# Altium schematic sheet Stepper.SchDoc
size 420 x 297 mm; SheetNumber: 3; SheetTotal: 4
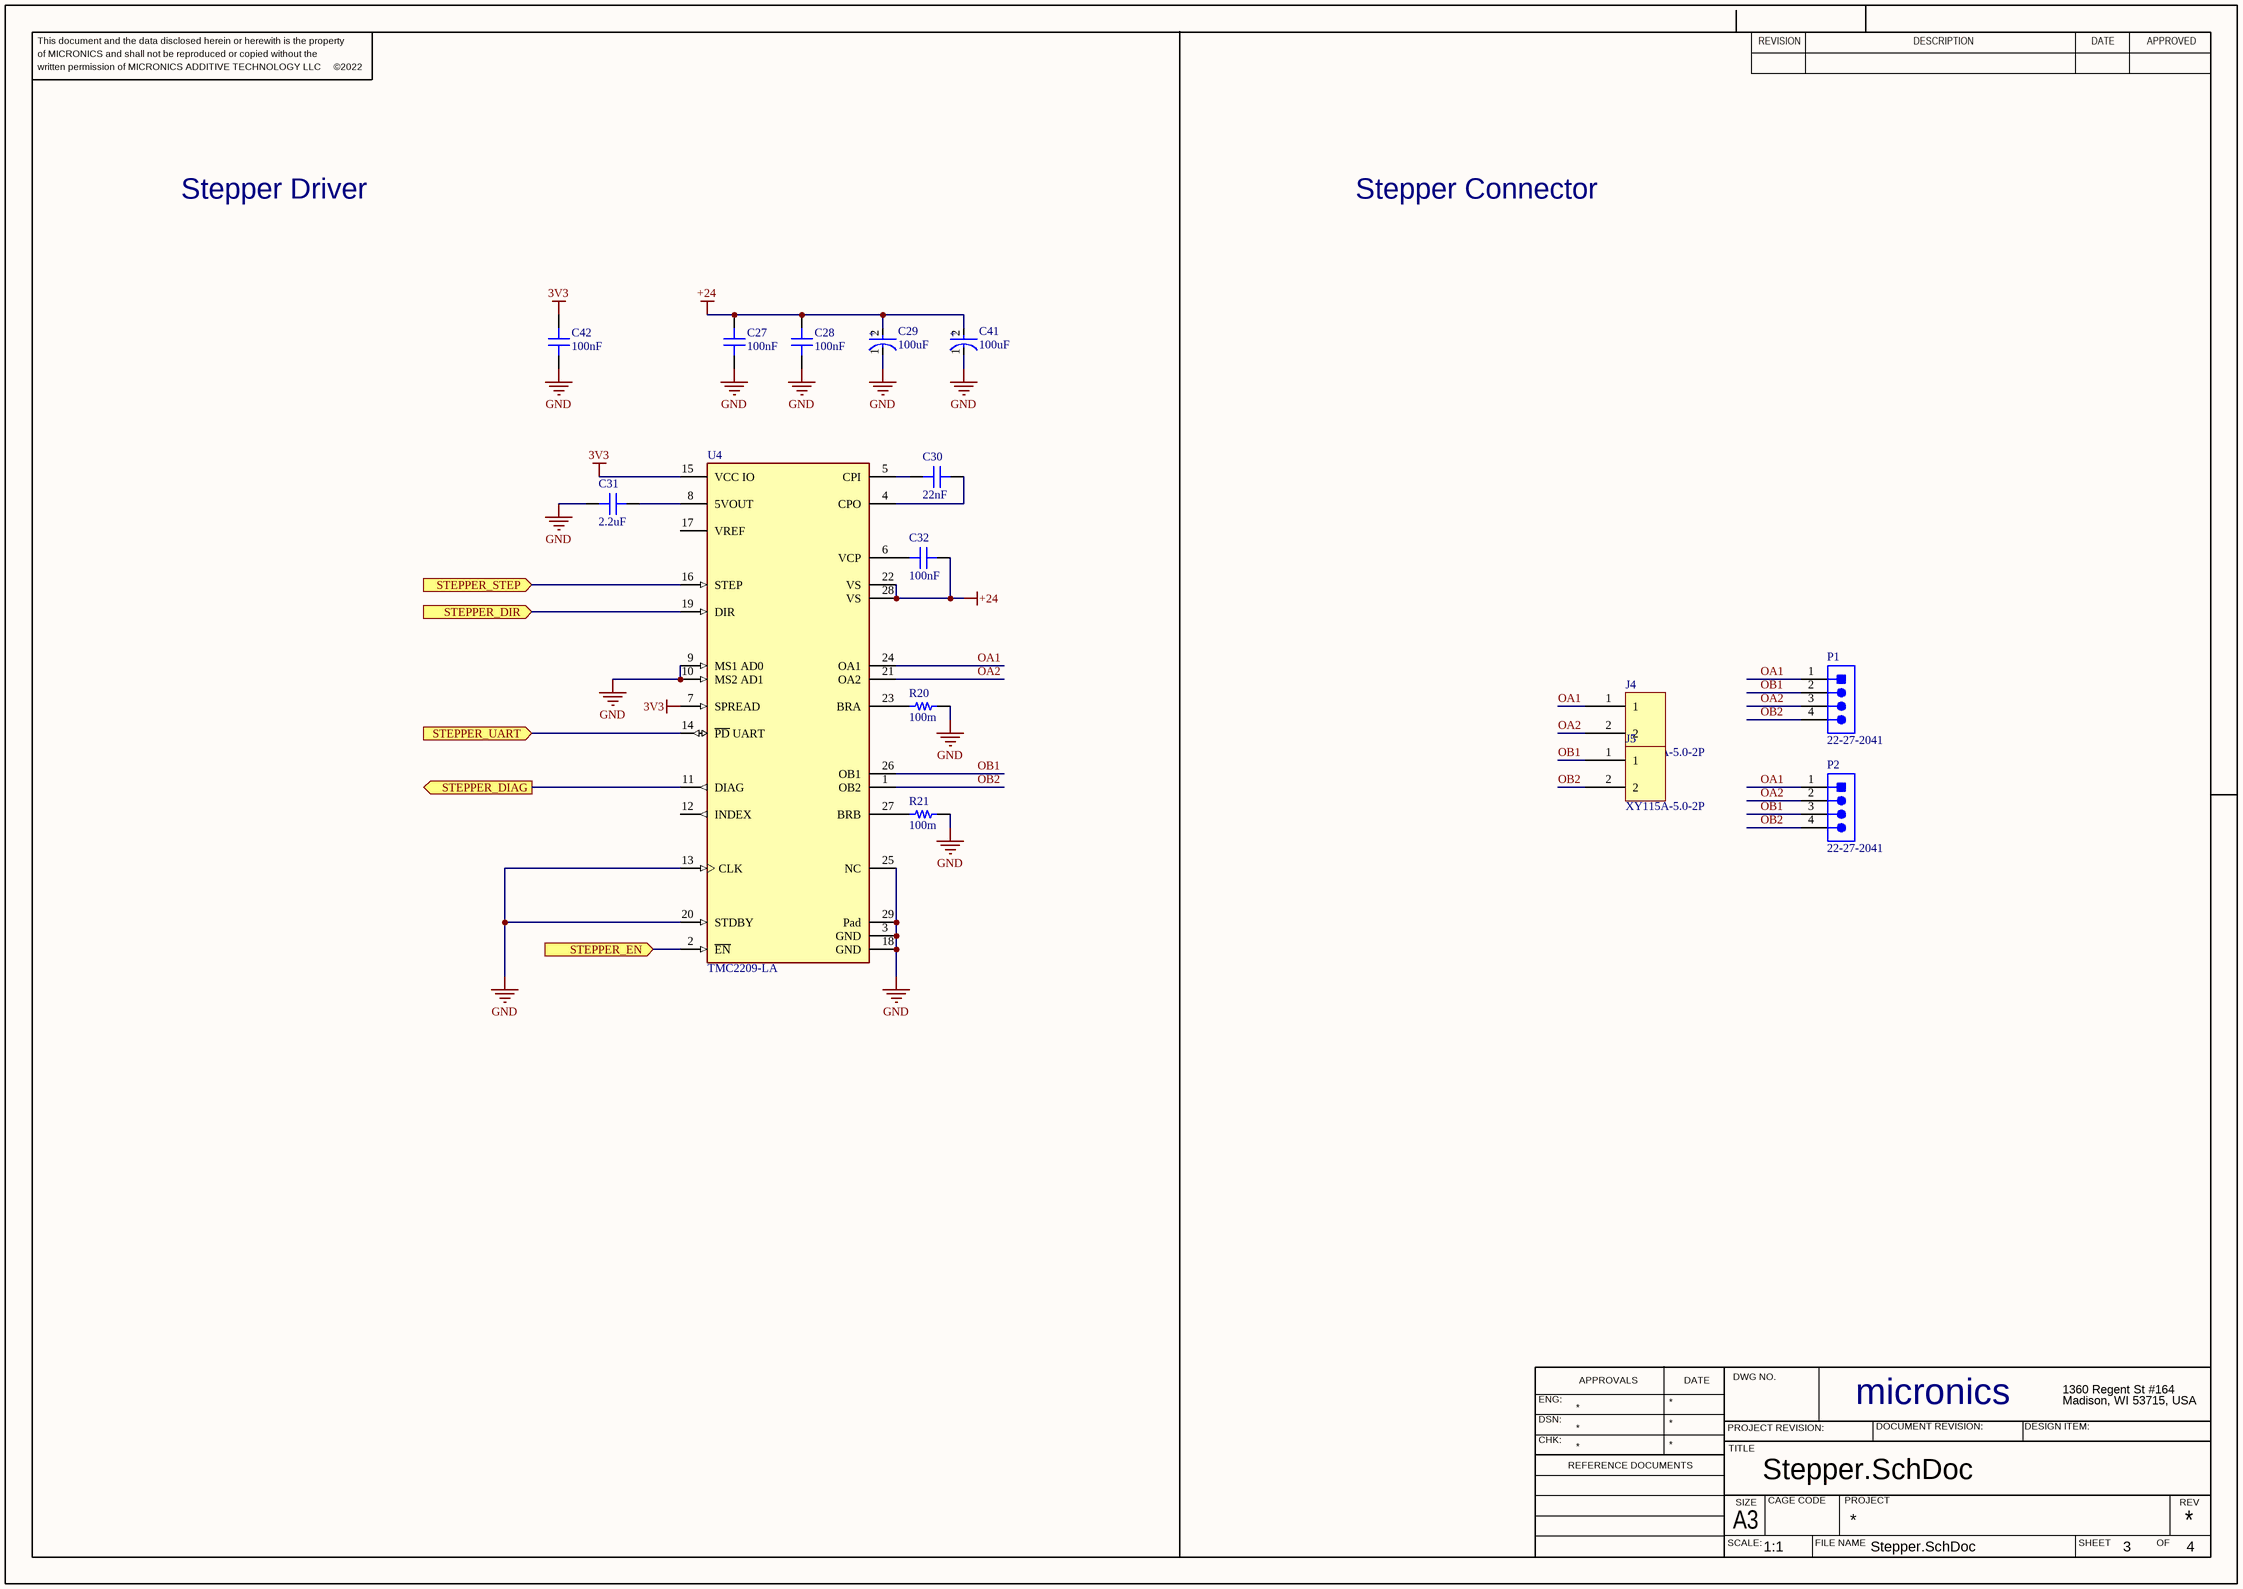
[diagram p0: Stepper.SchDoc]

## Parts
C27  100nF  [CAP 0603_1608]
C28  100nF  [CAP 0603_1608]
C29  100uF  [FP-SGV8X10_5-MFG]
C30  22nF  [CAP 0603_1608]
C31  2.2uF  [CAP 0603_1608]
C32  100nF  [CAP 0603_1608]
C41  100uF  [FP-SGV8X10_5-MFG]
C42  100nF  [CAP 0603_1608]
J4  XY115A-5.0-2P  [2.54-2PLTDK]
J5  XY115A-5.0-2P  [2.54-2PLTDK]
P1  22-27-2041  [MOLX-22-27-2041_V]
P2  22-27-2041  [MOLX-22-27-2041_V]
R20  100m  [RES 1206_3216]
R21  100m  [RES 1206_3216]
U4  TMC2209-LA  [FP-TMC2209-LA-IPC_C]

## Ports
STEPPER_DIAG (out, see ESP32[2A]), STEPPER_DIR (in, see ESP32[2A]), STEPPER_EN (in, see ESP32[2A]), STEPPER_STEP (in, see ESP32[2A]), STEPPER_UART (in, see ESP32[2A])

## Nets
3V3: C42.1 U4.7(SPREAD) U4.15(VCC_IO)
+24: C27.1 C28.1 C29.2(A) C32.1 C41.2(A) U4.22(VS) U4.28(VS)
GND: C27.2 C28.2 C29.1(C) C31.1 C41.1(C) C42.2 R20.2 R21.2 U4.3(GND) U4.9(MS1_AD0) U4.10(MS2_AD1) U4.13(CLK) U4.18(GND) U4.20(STDBY) U4.25(NC) U4.29(Pad)
OA1: J4.1 P1.1 P2.1 U4.24(OA1)
OA2: J4.2 P1.3 P2.2 U4.21(OA2)
OB1: J5.1 P1.2 P2.3 U4.26(OB1)
OB2: J5.2 P1.4 P2.4 U4.1(OB2)
STEPPER_DIAG: U4.11(DIAG) ; port STEPPER_DIAG
STEPPER_DIR: U4.19(DIR) ; port STEPPER_DIR
STEPPER_EN: U4.2(~{EN}) ; port STEPPER_EN
STEPPER_STEP: U4.16(STEP) ; port STEPPER_STEP
STEPPER_UART: U4.14(~{PD}_UART) ; port STEPPER_UART
NetC30_1: C30.1 U4.4(CPO)
NetC30_2: C30.2 U4.5(CPI)
NetC31_2: C31.2 U4.8(5VOUT)
NetC32_2: C32.2 U4.6(VCP)
NetR20_1: R20.1 U4.23(BRA)
NetR21_1: R21.1 U4.27(BRB)

Not connected (* = marked no-connect by the designer): U4 12(INDEX) 17(VREF)

## Notes on the sheet
- Stepper Driver
- Stepper Connector
- This document and the data disclosed herein or herewith is the property
- of MICRONICS and shall not be reproduced or copied without the
- REVISION
- DESCRIPTION
- DATE
- APPROVED
- written permission of MICRONICS ADDITIVE TECHNOLOGY LLC     ©2022
- ENG:
- APPROVALS
- DWG NO.
- micronics
- 1360 Regent St #164
- Madison, WI 53715, USA
- DSN:
- CHK:
- REFERENCE DOCUMENTS
- PROJECT REVISION:
- TITLE
- DOCUMENT REVISION:
- DESIGN ITEM:
- SCALE:
- A3
- SIZE
- CAGE CODE
- FILE NAME
- PROJECT
- SHEET
- OF
- REV
- 1:1
- (in symbol CMP-35376-000016-1) +

## Library data of the parts
C27 C28 C32 C42 = 250X14W223MV4T: C14663; manufacturer: Johanson Dielectrics Inc.; Temperature Coefficient: X7R; Tolerance: ±20%; Voltage - Rated: 25V; Part Number: 250X14W223MV4T; Value: 100nF; Applications: Bypass, Decoupling; Capacitance: 100nF; componentlink1description: Datasheet; componentlink1url: https://www.johansondielectrics.com/downloads/x2y-filter-and-decoupling-capacitors.pdf; componentlink2description: DigiKey Link; componentlink2url: https://www.digikey.com/en/products/detail/johanson-dielectrics-inc/250X14W223MV4T/1628740; Device Package: 0603 (1608 Metric); Features: Low ESL (X2Y); lastupdated: 2022-05-16 11:25:57 AM; Lifecycle Status: Active; Minimum Order: 1; Mounting Type: Surface Mount, MLCC; Operating Temperature: -55°C ~ 125°C; Package / Case: 0603 (1608 Metric); packaging: TapeAndReel; partid: 14325; Part Status: Active; price: 0.07; series: X2Y®; Size / Dimension: 0.064" L x 0.035" W (1.63mm x 0.89mm); Supplier 1: DigiKey; Supplier Part Number 1: 709-1087-1-ND; Thickness (Max): 0.026" (0.66mm)
C29 C41 = CMP-35376-000016-1: C445063; Voltage Rating: 50V; Life (Hours): 2000Hour; Tolerance: 20%; Ripple Current: 230mA; Leakage Current: 3uA; Lead Diameter: 1.1mm; Min Operating Temperature: -55°C; Mount: Surface Mount; Series: SGV; Case/Package: Radial; RoHS Compliant: Yes; Package Quantity: 500; Max Operating Temperature: 105°C; Height: 10.5mm; Packaging: Tape and Reel; Construction: Cylindrical; Voltage: 50V; Diameter: 8mm; Lead Pitch: 3.1mm; Termination: SMD/SMT; Height - Seated (Max): 0.413inch; Lead Free: Lead Free; Capacitance: 100uF; Radiation Hardening: No
C30 = 250X14W223MV4T: C21122; manufacturer: Johanson Dielectrics Inc.; Temperature Coefficient: X7R; Tolerance: ±20%; Voltage - Rated: 25V; Part Number: 250X14W223MV4T; Value: 22nF; Applications: Bypass, Decoupling; Capacitance: 22nF; componentlink1description: Datasheet; componentlink1url: https://www.johansondielectrics.com/downloads/x2y-filter-and-decoupling-capacitors.pdf; componentlink2description: DigiKey Link; componentlink2url: https://www.digikey.com/en/products/detail/johanson-dielectrics-inc/250X14W223MV4T/1628740; Device Package: 0603 (1608 Metric); Features: Low ESL (X2Y); lastupdated: 2022-05-20 2:39:33 PM; Lifecycle Status: Active; Minimum Order: 1; Mounting Type: Surface Mount, MLCC; Operating Temperature: -55°C ~ 125°C; Package / Case: 0603 (1608 Metric); packaging: TapeAndReel; partid: 14325; Part Status: Active; price: 0.07; series: X2Y®; Size / Dimension: 0.064" L x 0.035" W (1.63mm x 0.89mm); Supplier 1: DigiKey; Supplier Part Number 1: 709-1087-1-ND; Thickness (Max): 0.026" (0.66mm)
C31 = 250X14W223MV4T: C23630; manufacturer: Johanson Dielectrics Inc.; Temperature Coefficient: X7R; Tolerance: ±20%; Voltage - Rated: 25V; Part Number: 250X14W223MV4T; Value: 2.2uF; Applications: Bypass, Decoupling; Capacitance: 2.2uF; componentlink1description: Datasheet; componentlink1url: https://www.johansondielectrics.com/downloads/x2y-filter-and-decoupling-capacitors.pdf; componentlink2description: DigiKey Link; componentlink2url: https://www.digikey.com/en/products/detail/johanson-dielectrics-inc/250X14W223MV4T/1628740; Device Package: 0603 (1608 Metric); Features: Low ESL (X2Y); lastupdated: 2022-05-20 2:39:33 PM; Lifecycle Status: Active; Minimum Order: 1; Mounting Type: Surface Mount, MLCC; Operating Temperature: -55°C ~ 125°C; Package / Case: 0603 (1608 Metric); packaging: TapeAndReel; partid: 14325; Part Status: Active; price: 0.07; series: X2Y®; Size / Dimension: 0.064" L x 0.035" W (1.63mm x 0.89mm); Supplier 1: DigiKey; Supplier Part Number 1: 709-1087-1-ND; Thickness (Max): 0.026" (0.66mm)
J4 J5 = 2.54-2PLTDK: C784935
P1 P2 = CMP-2000-05243-1: C504991; Manufacturer: Molex; Voltage rating: 250V; Current rating: 4A; Datasheet Version: Rev. F, 06/2009; Operating temperature: 0degCto+75degC; Contact material: Tinplatedbrass; Manufacturer URL: http://www.molex.com/; Housing material: Nylon(UL94V-0); Datasheet URL: http://www.molex.com/pdm_docs/sd/022272041_sd.pdf
R20 R21 = KRL1632E-M-R012-F-T5: C25334; Manufacturer: Susumu; Power (Watts): 0.75W, 3/4W; Temperature Coefficient: ±50ppm/°C; Tolerance: ±1%; Part Number: KRL1632E-M-R012-F-T5; ComponentLink1Description: Datasheet; ComponentLink1URL: http://www.susumu.co.jp/common/pdf/n_catalog_partition09_en.pdf; ComponentLink2Description: DigiKey Link; ComponentLink2URL: https://www.digikey.com/en/products/detail/susumu/KRL1632E-M-R012-F-T5/3737997; Composition: Metal Foil; Device Package: 1206 (3216 Metric); Features: Automotive AEC-Q200, Current Sense; Height - Seated (Max): 0.028" (0.70mm); LastUpdated: 2024-02-09 8:54:46 PM; Lifecycle Status: Active; Minimum Order: 1; Number of Terminations: 2; Operating Temperature: -55°C ~ 155°C; Package / Case: 1206 (3216 Metric); Packaging: TapeAndReel; PartId: 26839; Part Status: Active; Price: 0.09; Ratings: AEC-Q200; Resistance: 100m; Series: KRL; Size / Dimension: 0.126" L x 0.063" W (3.20mm x 1.60mm); Supplier 1: DigiKey; Supplier Part Number 1: 408-1571-1-ND; Supplier Device Package: 1206; Value: 100m
U4 = CMP-237673-000004-1: C465949; Manufacturer: Trinamic; Nominal Supply Current: 7-7.5mA; Max Supply Voltage: 29V; Output Current: 2.8A; Standoff Height: 0mm; Motor Type: Stepper; Max Junction Temp: +125°C; Max Power Dissipation: 2.8W; Min Supply Voltage: 1.5V; Number Of Outputs: 1; RoHS: TRUE; ComponentLink2Description: Datasheet; Temperature: -40°C to +125°C; Ipc Land Pattern Name: QFN50P500X500X85-28; Lead Free: Yes; Device Class L1: Integrated Circuits (ICs); ComponentLink2URL: https://www.trinamic.com/fileadmin/assets/Products/ICs_Documents/TMC2209_Datasheet_V103.pdf; Device Class L2: Power Management ICs; Temperature Range Low: -40°C; Automotive: No; Manufacturer Part Number: TMC2209-LA; Category: IC; Height: 0.9mm; Package: 0; Device Class L3: Motor Drivers; Octopart: https://octopart.com/tmc2209-la-trinamic-105993617; Temperature Range High: +125°C